# Altium schematic sheet Pico_PSU.SchDoc: Title
size 420 x 297 mm; Author: G.Kasprowicz; CompanyName: WUT ISE; DrawnBy: G.Kasprowicz; Organization: WUT ISE; Address1: PW ISE; Address2: Nowowiejska 15/19 00-665 Warsaw; Address3: gkasprow@gmail.com; Revision: 2; SheetNumber: -; SheetTotal: -; ModifiedBy: -; CheckedDate: -; Title2: Title 2; DivGrp: WUT ISE; Designer: G.Kasprowicz; ModifiedDate: -; ProjectName: Sensor Box
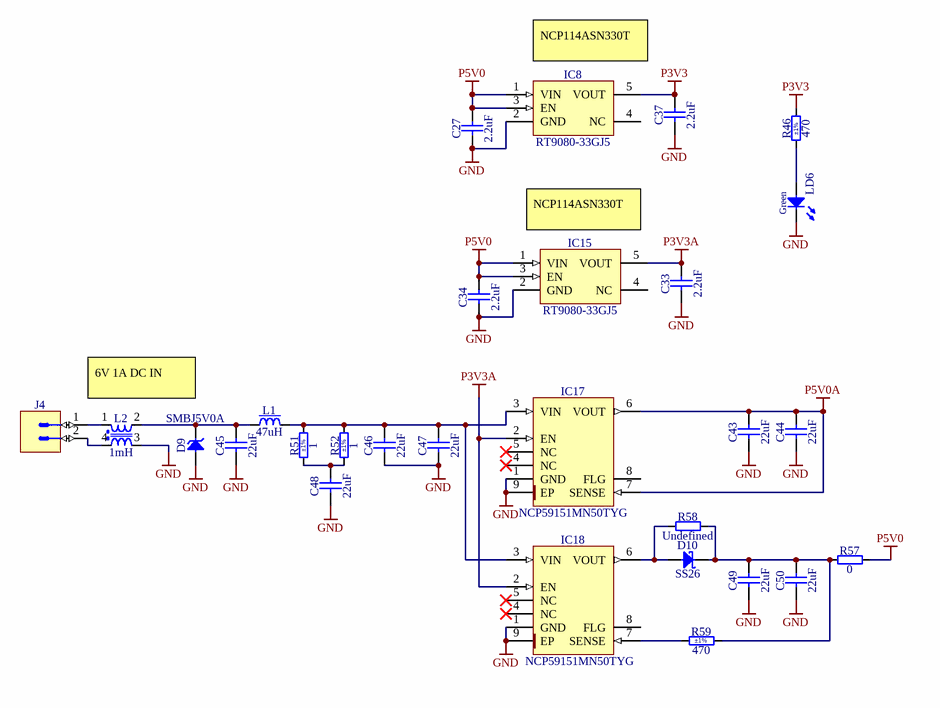
[diagram p0: Pico_PSU.SchDoc]

## Parts
C27  2.2uF  [CAPC1608X90N]
C33  2.2uF  [CAPC1608X90N]
C34  2.2uF  [CAPC1608X90N]
C37  2.2uF  [CAPC1608X90N]
C43  22uF  [CAPC3216X180N]
C44  22uF  [CAPC3216X180N]
C45  22uF  [CAPC3216X180N]
C46  22uF  [CAPC3216X180N]
C47  22uF  [CAPC3216X180N]
C48  22uF  [CAPC3216X180N]
C49  22uF  [CAPC3216X180N]
C50  22uF  [CAPC3216X180N]
D9  SMBJ5V0A  [DIOM5336X265N]
D10  SS26  [DIOM5336X265N]
IC8  RT9080-33GJ5  [SOT95P280X100-5N]
IC15  RT9080-33GJ5  [SOT95P280X100-5N]
IC17  NCP59151MN50TYG  [SON80P400X400X100-9N-R221X239]
IC18  NCP59151MN50TYG  [SON80P400X400X100-9N-R221X239]
J4  (no value)  [PHOENIX_1803277]
L1  47uH  [IND_WURTH_WE-LHMI_7050]
L2  1mH  [IND_BOURNS_SRF1006]
LD6  Green  [LED_AVAGO_HSME-C110]
R46  470  Tolerance: ±1%  [RESC1608X55N]
R51  1  Tolerance: ±1%  [RESC1608X55N]
R52  1  Tolerance: ±1%  [RESC1608X55N]
R57  0  [RESC1608X55N]
R58  Undefined  [RESC1608X55N]
R59  470  Tolerance: ±1%  [RESC1608X55N]

## Nets
GND: C27.1 C33.1 C34.1 C37.1 C43.1 C44.1 C45.1 C46.1 C47.1 C48.1 C49.1 C50.1 D9.2(A) IC8.2(GND) IC15.2(GND) IC17.1(GND) IC17.9(EP) IC18.1(GND) IC18.9(EP) L2.3 LD6.1(C)
P3V3: C37.2 IC8.5(VOUT) R46.2
P3V3A: C33.2 IC15.5(VOUT) IC17.2(EN) IC18.2(EN)
P5V0: C27.2 C34.2 IC8.1(VIN) IC8.3(EN) IC15.1(VIN) IC15.3(EN) R57.2
P5V0A: C43.2 C44.2 IC17.6(VOUT) IC17.7(SENSE)
NetC45_2: C45.2 D9.1(C) L1.1 L2.2
NetC46_2: C46.2 C47.2 IC17.3(VIN) IC18.3(VIN) L1.2 R51.2 R52.2
NetC48_2: C48.2 R51.1 R52.1
NetC49_2: C49.2 C50.2 D10.1(C) R57.1 R58.2 R59.2
NetD10_2: D10.2(A) IC18.6(VOUT) R58.1
NetIC18_7: IC18.7(SENSE) R59.1
NetJ4_1: J4.1 L2.1
NetJ4_2: J4.2 L2.4
NetLD6_2: LD6.2(A) R46.1

Not connected (* = marked no-connect by the designer): IC8 4(NC); IC15 4(NC); IC17 4(NC)* 5(NC)* 8(FLG); IC18 4(NC)* 5(NC)* 8(FLG)

## Notes on the sheet
- NCP114ASN330T
- (near IC15) NCP114ASN330T
- 6V 1A DC IN
- Project/Equipment
- Document
- Designer
- Drawn by
- Check.by
- Copyright WUT ISE 2020.
  This documentation describes Open Hardware and is licensed under the CERN OHL v.1.2. You may redistribute and modify this documentation under the terms of the CERN OHL v.1.2. (http://ohwr.org/CERNOHL). This documentation is distributed WITHOUT ANY EXPRESS OR IMPLIED WARRANTY, INCLUDING OF MERCHANTABILITY, SATISFACTORY QUALITY AND FITNESS FOR A PARTICULAR PURPOSE. Please see the CERN OHL v.1.2 for applicable conditions.
- Contact
- File
- Last Mod.
- Print Date
- Sheet
- Size
- A3
- of
- Rev

## Library data of the parts
C27 C33 C34 C37 = CC0603_2.2UF_10V_20%_X7R: Non-polarised capacitor; Part Description: SMD Multilayer Chip Ceramic Capacitor; Manufacturer: GENERIC; Manufacturer1 Part Number: LMK107B7225MA-T; Voltage: 10V; TC: X7R; Tolerance: ±20%; Part Number: CC0603_2.2UF_10V_20%_X7R; Component Kind: Standard; Component Type: Standard; Pin Count: 2; Value: 2.2uF; Status: Not Recommended; Manufacturer Part Number: CC0603_2.2UF_10V_20%_X7R; Case: 0603; Mounted: Yes; Socket: No; SMD: Yes; Sense: No; Manufacturer1 Example: TAIYO YUDEN; Manufacturer1 ComponentHeight: 0.9mm; HelpURL: \\cern.ch\dfs\Applications\Altium\Datasheets\CC0603_X7R_TAIYO-YUDEN_HIGH-VALUE.pdf; Author: CERN DEM JLC; CreateDate: 22.06.2011; LatestRevisionDate: 27.06.2011
C43-C50 = CC1206_22UF_10V_10%_X7R: Non-polarised capacitor; Part Description: SMD Multilayer Chip Ceramic Capacitor; Manufacturer: GENERIC; Manufacturer1 Part Number: GRM31CR71A226KE15L; Voltage: 10V; TC: X7R; Tolerance: ±10%; Part Number: CC1206_22UF_10V_10%_X7R; Component Kind: Standard; Component Type: Standard; Pin Count: 2; Value: 22uF; Status: Preferred; Manufacturer Part Number: CC1206_22UF_10V_10%_X7R; Case: 1206; Mounted: Yes; Socket: No; SMD: Yes; Sense: No; Manufacturer1 Example: MURATA; Manufacturer1 ComponentHeight: 1.8mm; HelpURL: \\cern.ch\dfs\Applications\Altium\Datasheets\CC1206_X7R_MURATA_GRM-HI-CAP.pdf; Author: CERN DEM JLC; CreateDate: 08.06.2010; LatestRevisionDate: 08.06.2010
D9 = SMBJ5V0A: Zener Diode; Part Description: Uni-Directional Transient Voltage Suppressor Diode; Manufacturer: FAIRCHILD SEMICONDUCTOR; Voltage: 5V; Power: 600W; PressFit: No; Bonding: No; Part Number: SMBJ5V0A; Component Kind: Standard; Component Type: Standard; Device: SMBJ5V0A; PackageDescription: DO-214-AA/SMB Diode, Molded Body; 5.34mm L X 3.625mm W X 2.65mm H, IPC Medium Density; Manufacturer Part Number: SMBJ5V0A; Pin Count: 2; Case: DO-214AA; Mounted: Yes; Socket: No; SMD: Yes; Sense: No; ComponentHeight: 2.65mm; HelpURL: \\cern.ch\dfs\Applications\Altium\Datasheets\SMBJ.pdf; Author: CERN DEM JLC; CreateDate: 08.12.2008; LatestRevisionDate: 19.12.2011
D10 = SS26: Schottky Diode; Part Description: Schottky Rectifier; Manufacturer: FAIRCHILD SEMICONDUCTOR; Voltage: 60V; Power: 2A; PressFit: No; Bonding: No; Part Number: SS26; Component Kind: Standard; Component Type: Standard; Device: SS26; PackageDescription: DO-214-AA/SMB Diode, Molded Body; 5.34mm L X 3.625mm W X 2.65mm H, IPC Medium Density; Manufacturer Part Number: SS26; Pin Count: 2; Case: DO-214AA; Mounted: Yes; Socket: No; SMD: Yes; Sense: No; ComponentHeight: 2.65mm; HelpURL: \\cern.ch\dfs\Applications\Altium\Datasheets\SS26.pdf; Author: CERN DEM JMW; CreateDate: 10.07.2015; LatestRevisionDate: 10.07.2015
IC8 IC15 = RT9080-33GJ5: 600mA, Low-Dropout Linear Regulator; Part Description: 3.3V, 600mA, Low-Dropout Linear Regulator; Manufacturer: RICHTEK; PressFit: No; Bonding: No; Part Number: RT9080-33GJ5; Component Kind: Standard; Component Type: Standard; Device: RT9080-33GJ5; PackageDescription: SOT23, 0.95mm Pitch; 5 Pin, 1.60mm W X 2.90mm L X 1.00mm H body, IPC Medium Density; Manufacturer Part Number: RT9080-33GJ5; Pin Count: 5; Case: SOT23-5; Mounted: Yes; Socket: No; SMD: Yes; Sense: No; ComponentHeight: 1mm; HelpURL: \\cern.ch\dfs\Applications\Altium\Datasheets\RT9080-33GJ5.pdf; Author: CERN DEM BC; CreateDate: 02.03.2020; LatestRevisionDate: 02.03.2020
IC17 IC18 = NCP59151MN50TYG: 1.5 A, Very Low-Dropout (VLDO) Fast Transient Response Regulator; Part Description: 5V, 1.5A, Very Low-Dropout (VLDO) Fast Transient Response Regulator; Manufacturer: ON SEMICONDUCTOR; PressFit: No; Bonding: No; Part Number: NCP59151MN50TYG; Component Kind: Standard; Component Type: Standard; Device: NCP59151MN50TYG; PackageDescription: SON, 0.80mm Pitch, 8 Pin, 4mm X 4mm X 1.00mm H Body (w/Thermal Tab 2.21 X 2.39mm),  IPC Medium Density; Manufacturer Part Number: NCP59151MN50TY; Pin Count: 9; Case: SON8; Mounted: Yes; Socket: No; SMD: Yes; Sense: No; ComponentHeight: 1mm; HelpURL: \\cern.ch\dfs\Applications\Altium\Datasheets\NCP59151MN50TYG.pdf; Author: CERN DEM JLC; CreateDate: 27.11.2013; LatestRevisionDate: 24.05.2022
J4 = PHOENIX_1803277: Connector 2 Male; Part Description: 8A 160 V, Pitch: 3.81mm, 2 Positions  Right Angled Header; Manufacturer: PHOENIX CONTACT; Manufacturer Part Number: 1803277 (MC 1,5/ 2-G-3,81); PressFit: No; Part Number: PHOENIX_1803277; Component Kind: Standard; Component Type: Standard; Pin Count: 2; Mounted: Yes; Socket: No; SMD: No; Sense: No; Status: None; ComponentHeight: 7.25mm; HelpURL: \\cern.ch\dfs\Applications\Altium\Datasheets\PHOENIX_1803277.pdf; Author: CERN DEM JLC; CreateDate: 06.05.2014; LatestRevisionDate: 06.05.2014
L1 = IND_47UH_20%_WURTH_WE-LHMI_74437349470: Inductor With Core; Part Description: SMD Power Inductor (WE-LHMI Series); Manufacturer: WURTH ELEKTRONIK; Power: 1.45A; Resistance: 0.290R; Tolerance: ±20%; Part Number: IND_47UH_20%_WURTH_WE-LHMI_74437349470; Component Kind: Standard; Component Type: Standard; Pin Count: 2; Value: 47uH; Manufacturer Part Number: 74437349470; Mounted: Yes; Socket: No; SMD: Yes; Sense: No; ComponentHeight: 5mm; HelpURL: \\cern.ch\dfs\Applications\Altium\Datasheets\IND_WURTH_WE-LHMI_74437349470.pdf; Author: CERN DEM HF; CreateDate: 22.11.2023; LatestRevisionDate: 22.11.2023
L2 = IND_1MH_40%_BOURNS_SRF1006: Inductor Common Mode; Part Description: Line Filter, Common Mode Choke; Manufacturer: BOURNS; Manufacturer Part Number: SRF1006-102Y; Power: 0.95A; Resistance: 0.180R; Tolerance: ±40%; Part Number: IND_1MH_40%_BOURNS_SRF1006; Component Kind: Standard; Component Type: Standard; Pin Count: 2; Value: 1mH; Mounted: Yes; Socket: No; SMD: Yes; Sense: No; ComponentHeight: 6.5mm; HelpURL: \\cern.ch\dfs\Applications\Altium\Datasheets\IND_BOURNS_SRF1006.pdf; Author: CERN DEM HF; CreateDate: 30.01.2024; LatestRevisionDate: 30.01.2024
LD6 = LED_AVAGO_HSME-C110: LED Green 1C 2A; Part Description: High Performance Right Angle Chip Green LED; Manufacturer: AVAGO TECHNOLOGIES; PressFit: No; Bonding: No; Part Number: LED_AVAGO_HSME-C110; Component Kind: Standard; Component Type: Standard; Color: Green; PackageDescription: Green Chip LED, 2-Leads, Body 3.3x1.6mm, Side Emitting Package; Manufacturer Part Number: HSME-C110; Pin Count: 2; Case: 1206; Mounted: Yes; Socket: No; SMD: Yes; Sense: No; ComponentHeight: 1.1mm; HelpURL: \\cern.ch\dfs\Applications\Altium\Datasheets\LED_AVAGO_HSME-C110.pdf; ComponentLink1URL: \\cern.ch\dfs\Applications\Altium\Datasheets\LED_AVAGO_HSME-C110_DESIGN-GUIDE.pdf; ComponentLink1Description: Design Guide; Author: CERN DEM JMW; CreateDate: 30.07.2009; LatestRevisionDate: 20.06.2012
R46 R59 = R0603_470R_1%_0.1W_100PPM: Resistor - 1%; Part Description: General Purpose Thick Film Chip Resistor; Manufacturer: GENERIC; Manufacturer1 Part Number: NRC06F4700TRF; Power: 0.1W; TC: ±100ppm/°C; PressFit: No; Part Number: R0603_470R_1%_0.1W_100PPM; Component Kind: Standard; Component Type: Standard; Pin Count: 2; Value: 470; Status: Preferred; Manufacturer Part Number: R0603_470R_1%_0.1W_100PPM; Case: 0603; Mounted: Yes; Sense: No; Socket: No; SMD: Yes; Manufacturer1 Example: NIC COMPONENT; Manufacturer1 ComponentHeight: 0.55mm; HelpURL: \\cern.ch\dfs\Applications\Altium\Datasheets\R0603_NIC_NRC.pdf; Author: CERN DEM JLC; CreateDate: 03.12.2007; LatestRevisionDate: 13.03.2008
R51 R52 = R0603_1R_1%_0.1W_200PPM: Resistor - 1%; Part Description: General Purpose Thick Film Chip Resistor; Manufacturer: GENERIC; Manufacturer1 Part Number: 232270461008L or RC0603FR-071RL; Power: 0.1W; TC: ±200ppm/°C; PressFit: No; Part Number: R0603_1R_1%_0.1W_200PPM; Component Kind: Standard; Component Type: Standard; Pin Count: 2; Value: 1; Status: Preferred; Manufacturer Part Number: R0603_1R_1%_0.1W_200PPM; Case: 0603; Mounted: Yes; Sense: No; Socket: No; SMD: Yes; Manufacturer1 Example: YAGEO PHYCOMP; Manufacturer1 ComponentHeight: 0.65mm; HelpURL: \\cern.ch\dfs\Applications\Altium\Datasheets\R0603_Phycomp_RC0603.pdf; Author: CERN DEM JLC; CreateDate: 03.12.2007; LatestRevisionDate: 17.10.2012
R57 = R0603_0R_JUMPER: Resistor; Part Description: 1A (0.05R Max DC Resistance) Zero Ohm Jumper; Manufacturer: GENERIC; Manufacturer1 Part Number: NRC06Z0; PressFit: No; Part Number: R0603_0R_JUMPER; Component Kind: Standard; Component Type: Standard; Pin Count: 2; Value: 0; Status: Preferred; Manufacturer Part Number: R0603_0R_JUMPER; Case: 0603; Mounted: Yes; Sense: No; Socket: No; SMD: Yes; Manufacturer1 Example: NIC COMPONENT; Manufacturer1 ComponentHeight: 0.55mm; HelpURL: \\cern.ch\dfs\Applications\Altium\Datasheets\R0603_NIC_NRC.pdf; Author: CERN DEM JLC; CreateDate: 03.12.2007; LatestRevisionDate: 13.03.2008
R58 = R0603_NO-VALUE: Resistor; Part Description: Reserved Footprint For a 0603 (1608) Chip Resistor; PressFit: No; Mounted: No; Part Number: R0603_NO-VALUE; Component Kind: Standard; Component Type: Standard; Pin Count: 2; Value: Undefined; Status: None; Manufacturer: Undefined; Manufacturer Part Number: R0603_NO-VALUE; Case: 0603; Sense: No; Socket: No; SMD: Yes; Manufacturer1 Example: Undefined; Manufacturer1 Part Number: Undefined; Manufacturer1 ComponentHeight: Undefined; HelpURL: Undefined; Author: CERN DEM JLC; CreateDate: 03.12.2007; LatestRevisionDate: 13.03.2008